# EAGLE schematic pusher (EAGLE 9.3.2)
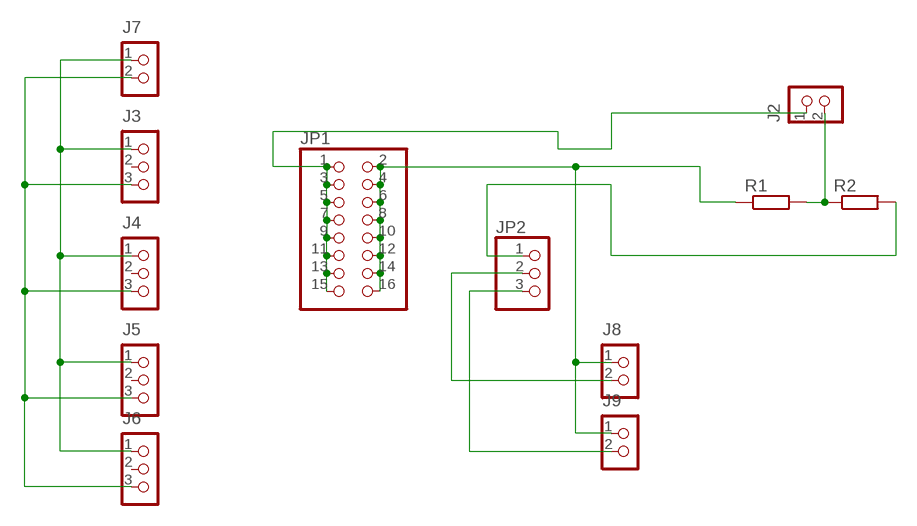
[diagram p0: schematic, sheet 1]

## Parts
J2  CON_TERMINAL_BLOCK_02-5MM  [TERMINAL_BLOCK_2P_5]
J3  CON_TERMINAL_BLOCK_03-5MM  [TERMINAL_BLOCK_3P_5]
J4  CON_TERMINAL_BLOCK_03-5MM  [TERMINAL_BLOCK_3P_5]
J5  CON_TERMINAL_BLOCK_03-5MM  [TERMINAL_BLOCK_3P_5]
J6  CON_TERMINAL_BLOCK_03-5MM  [TERMINAL_BLOCK_3P_5]
J7  CON_TERMINAL_BLOCK_02-5MM  [TERMINAL_BLOCK_2P_5]
J8  CON_TERMINAL_BLOCK_02-5MM  [TERMINAL_BLOCK_2P_5]
J9  CON_TERMINAL_BLOCK_02-5MM  [TERMINAL_BLOCK_2P_5]
JP1  PINHD-2X8  [2X08]
JP2  PINHD-1X3  [1X03]
R1  R-EU_0207/10  [0207/10]
R2  R-EU_0207/10  [0207/10]

## Nets
N$1: J2.1 JP1.1 JP1.3 JP1.5 JP1.7 JP1.9 JP1.11 JP1.13 JP1.15
N$2: J2.2 R1.2 R2.1
N$3: J8.1 J9.1 JP1.2 JP1.4 JP1.6 JP1.8 JP1.10 JP1.12 JP1.14 JP1.16 R1.1
N$4: JP2.1 R2.2
N$5: J8.2 JP2.2
N$6: J3.1 J4.1 J5.1 J6.1 J7.1
N$7: J9.2 JP2.3
N$9: J3.3 J4.3 J5.3 J6.3 J7.2
Unconnected: J3.2 J4.2 J5.2 J6.2

## Library data of the parts
J2 J8 J9 = dp_devices.v6:CON_TERMINAL_BLOCK_02: 2 poles wire to board terminal block
J3-J6 = dp_devices:CON_TERMINAL_BLOCK_03: 3 poles, wire to board connector
J7 = dp_devices:CON_TERMINAL_BLOCK_02: 2 poles wire to board terminal block
JP1 = pinhead:PINHD-2X8: PIN HEADER
JP2 = pinhead:PINHD-1X3: PIN HEADER
R1 R2 = rcl:R-EU_: RESISTOR, European symbol; SPICEPREFIX: R